# EAGLE schematic RaspiOmix (EAGLE 6.4)
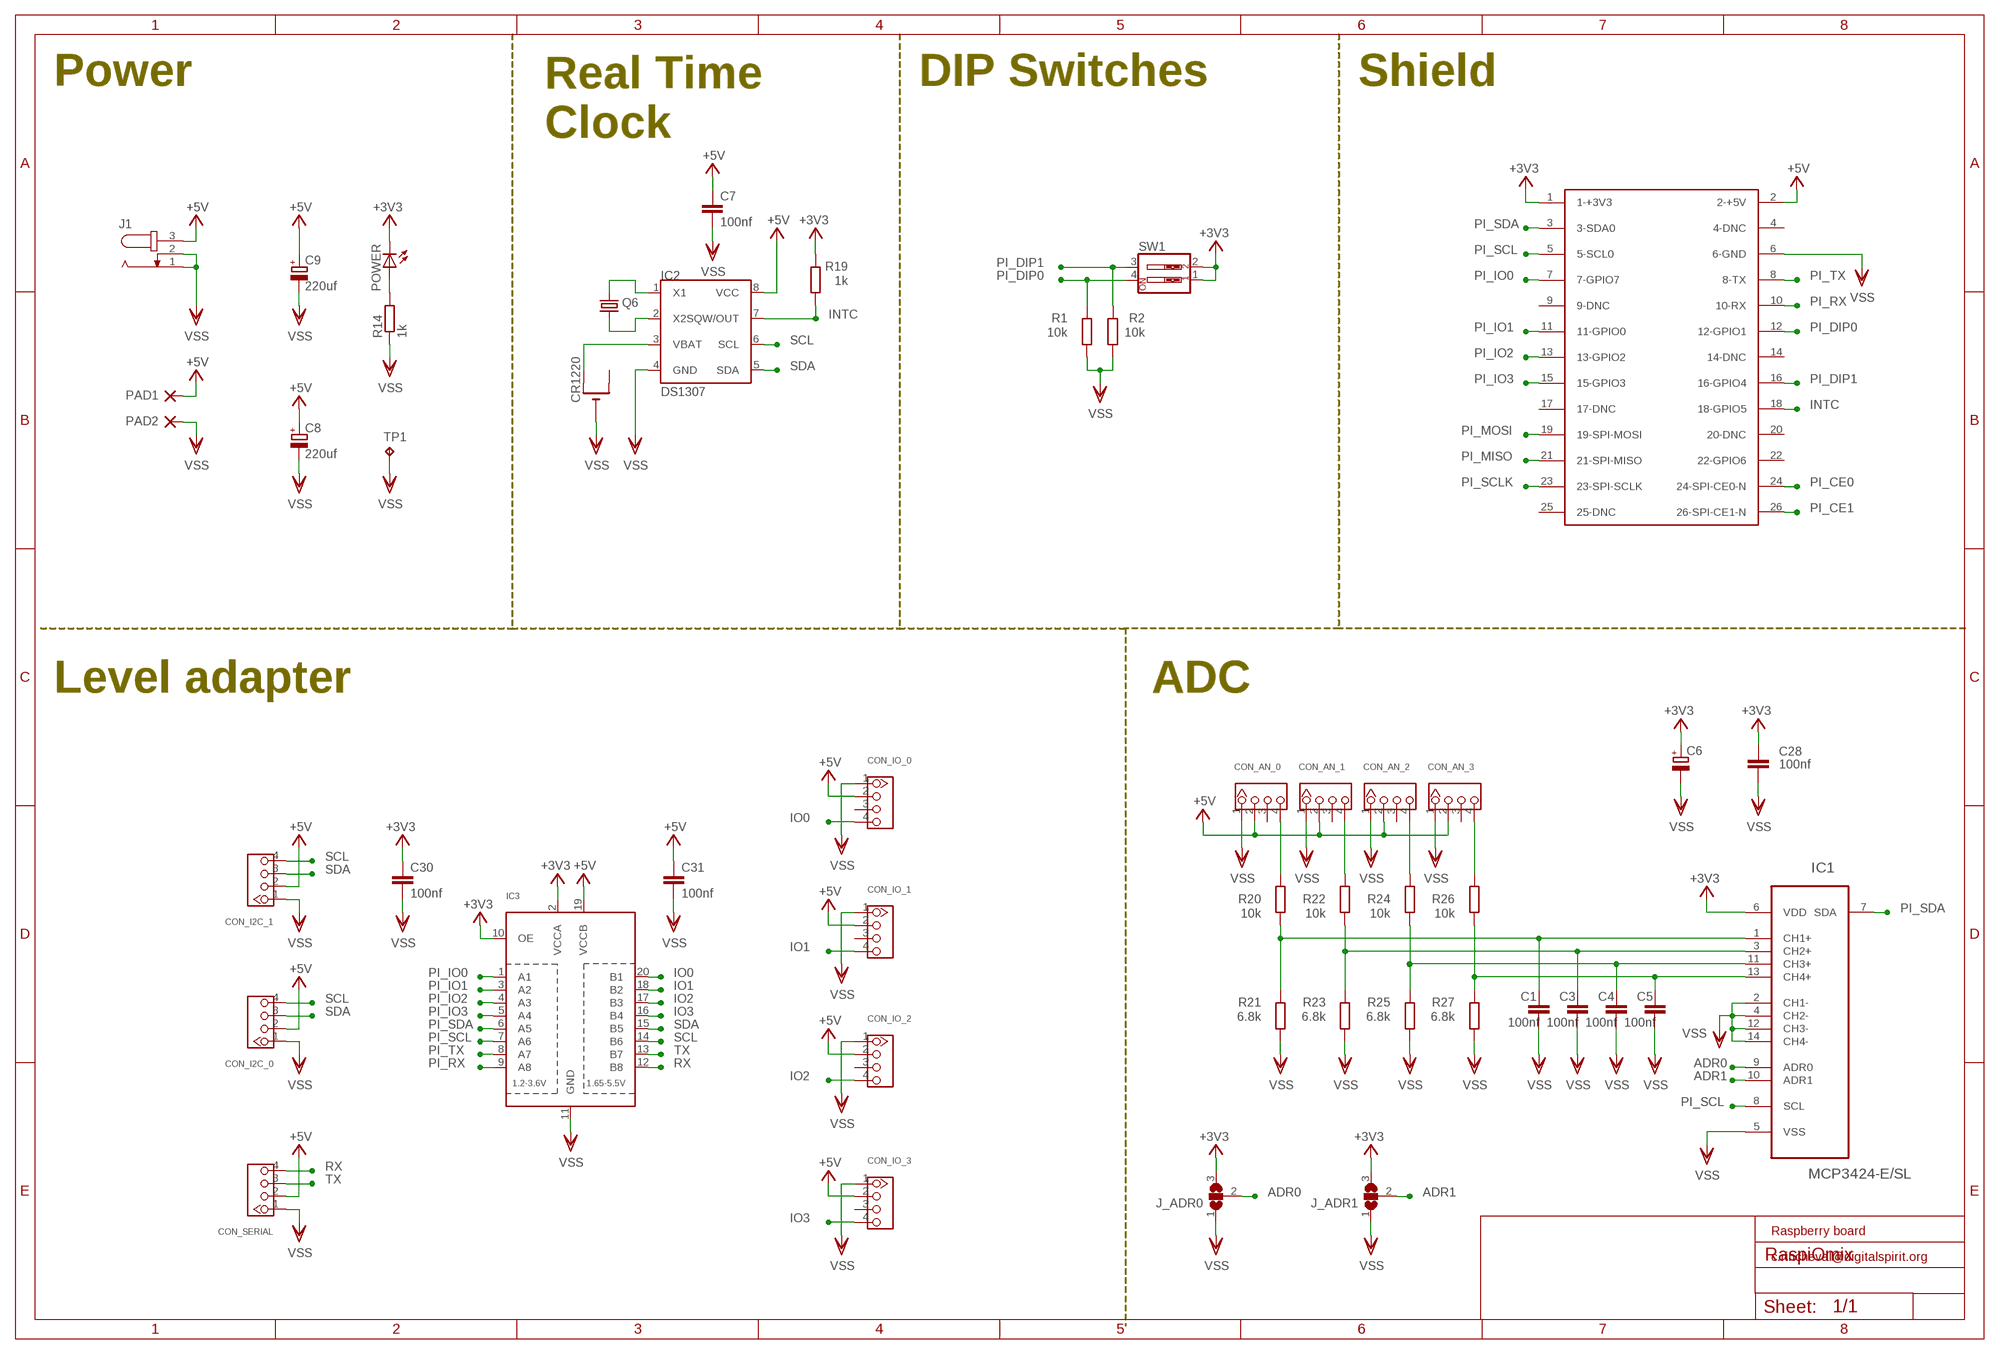
[diagram p0: schematic, sheet 1]

## Parts
C1  100nf  C-EUC0805  [C0805]
C3  100nf  C-EUC0805  [C0805]
C4  100nf  C-EUC0805  [C0805]
C5  100nf  C-EUC0805  [C0805]
C6  CPOL-EUB/3528-21R  [B/3528-21R]
C7  100nf  C-EUC0805  [C0805]
C8  220uf  CPOL-EUD  [PANASONIC_D]
C9  220uf  CPOL-EUD  [PANASONIC_D]
C28  100nf  C-EUC0805  [C0805]
C30  100nf  C-EUC0805  [C0805]
C31  100nf  C-EUC0805  [C0805]
CON_AN_0  TWIG-4P-2.0'90D'  [4P-2.0-90D]
CON_AN_1  TWIG-4P-2.0'90D'  [4P-2.0-90D]
CON_AN_2  TWIG-4P-2.0'90D'  [4P-2.0-90D]
CON_AN_3  TWIG-4P-2.0'90D'  [4P-2.0-90D]
CON_I2C_0  TWIG-4P-2.0'90D'  [4P-2.0-90D]
CON_I2C_1  TWIG-4P-2.0'90D'  [4P-2.0-90D]
CON_IO_0  TWIG-4P-2.0'90D'  [4P-2.0-90D]
CON_IO_1  TWIG-4P-2.0'90D'  [4P-2.0-90D]
CON_IO_2  TWIG-4P-2.0'90D'  [4P-2.0-90D]
CON_IO_3  TWIG-4P-2.0'90D'  [4P-2.0-90D]
CON_SERIAL  TWIG-4P-2.0'90D'  [4P-2.0-90D]
CR1220  CR1220THM  [CR1220-THM]
IC1  MCP3424-E/SL  [SOIC-14]
IC2  DS1307  [SOIC-8]
IC3  TXB0108PWR  [TSSOP20]
J1  JACK-PLUG0  [SPC4077]
J_ADR0  SJ2W  [SJ_2]
J_ADR1  SJ2W  [SJ_2]
PAD1  WIREPAD3,17/1,3  [3,17/1,3]
PAD2  WIREPAD3,17/1,3  [3,17/1,3]
POWER  LEDCHIPLED_0805  [CHIPLED_0805]
Q6  CRYSTALTC26H  [TC26H]
R1  10k  R-EU_M0805  [M0805]
R2  10k  R-EU_M0805  [M0805]
R14  1k  R-EU_M0805  [M0805]
R19  1k  R-EU_M0805  [M0805]
R20  10k  R-EU_M0805  [M0805]
R21  6.8k  R-EU_M0805  [M0805]
R22  10k  R-EU_M0805  [M0805]
R23  6.8k  R-EU_M0805  [M0805]
R24  10k  R-EU_M0805  [M0805]
R25  6.8k  R-EU_M0805  [M0805]
R26  10k  R-EU_M0805  [M0805]
R27  6.8k  R-EU_M0805  [M0805]
SW1  SW_DIP-2  [EDG-02]
TP1  TPPAD1-13  [P1-13]
U$3  RASPBERRY-PILIGHT-HOLE  [RASPBERRY-PI-LIGHT-HOLE]

## Nets
+3V3: C6.+ C28.2 C30.1 IC1.6(VDD) IC3.2(VCCA) IC3.10(OE) J_ADR0.3 J_ADR1.3 POWER.C R19.2 SW1.1 SW1.2 U$3.1(1-+3V3)
+5V: C7.1 C8.+ C9.+ C31.1 CON_AN_0.2 CON_AN_1.2 CON_AN_2.2 CON_AN_3.2 CON_I2C_0.2 CON_I2C_1.2 CON_IO_0.2 CON_IO_1.2 CON_IO_2.2 CON_IO_3.2 CON_SERIAL.2 IC2.8(VCC) IC3.19(VCCB) J1.3 PAD1.1(P) U$3.2(2-+5V)
ADR0: IC1.9(ADR0) J_ADR0.2
ADR1: IC1.10(ADR1) J_ADR1.2
INTC: IC2.7(SQW/OUT) R19.1 U$3.18(18-GPIO5)
IO0: CON_IO_0.4 IC3.20(B1)
IO1: CON_IO_1.4 IC3.18(B2)
IO2: CON_IO_2.4 IC3.17(B3)
IO3: CON_IO_3.4 IC3.16(B4)
N$1: CON_AN_0.4 R20.2
N$2: CON_AN_1.4 R22.2
N$3: CON_AN_2.4 R24.2
N$4: C5.1 IC1.13(CH4+) R26.1 R27.2
N$5: C4.1 IC1.11(CH3+) R24.1 R25.2
N$6: C3.1 IC1.3(CH2+) R22.1 R23.2
N$7: C1.1 IC1.1(CH1+) R20.1 R21.2
N$8: CON_AN_3.4 R26.2
N$33: IC2.1(X1) Q6.1
N$34: IC2.2(X2) Q6.2
N$39: POWER.A R14.2
N$58: CR1220.+1(+) IC2.3(VBAT)
PI_CE0: U$3.24(24-SPI-CE0-N)
PI_CE1: U$3.26(26-SPI-CE1-N)
PI_DIP0: R1.2 SW1.4 U$3.12(12-GPIO1)
PI_DIP1: R2.2 SW1.3 U$3.16(16-GPIO4)
PI_IO0: IC3.1(A1) U$3.7(7-GPIO7)
PI_IO1: IC3.3(A2) U$3.11(11-GPIO0)
PI_IO2: IC3.4(A3) U$3.13(13-GPIO2)
PI_IO3: IC3.5(A4) U$3.15(15-GPIO3)
PI_MISO: U$3.21(21-SPI-MISO)
PI_MOSI: U$3.19(19-SPI-MOSI)
PI_RX: IC3.9(A8) U$3.10(10-RX)
PI_SCL: IC1.8(SCL) IC3.7(A6) U$3.5(5-SCL0)
PI_SCLK: U$3.23(23-SPI-SCLK)
PI_SDA: IC1.7(SDA) IC3.6(A5) U$3.3(3-SDA0)
PI_TX: IC3.8(A7) U$3.8(8-TX)
RX: CON_SERIAL.4 IC3.12(B8)
SCL: CON_I2C_0.4 CON_I2C_1.4 IC2.6(SCL) IC3.14(B6)
SDA: CON_I2C_0.3 CON_I2C_1.3 IC2.5(SDA) IC3.15(B5)
TX: CON_SERIAL.3 IC3.13(B7)
VSS: C1.2 C3.2 C4.2 C5.2 C6.- C7.2 C8.- C9.- C28.1 C30.2 C31.2 CON_AN_0.1 CON_AN_1.1 CON_AN_2.1 CON_AN_3.1 CON_I2C_0.1 CON_I2C_1.1 CON_IO_0.1 CON_IO_1.1 CON_IO_2.1 CON_IO_3.1 CON_SERIAL.1 CR1220.- IC1.2(CH1-) IC1.4(CH2-) IC1.5(VSS) IC1.12(CH3-) IC1.14(CH4-) IC2.4(GND) IC3.11(GND) J1.1 J1.2 J_ADR0.1 J_ADR1.1 PAD2.1(P) R1.1 R2.1 R14.1 R21.1 R23.1 R25.1 R27.1 TP1.TP U$3.6(6-GND)
Unconnected: CON_AN_0.3 CON_AN_1.3 CON_AN_2.3 CON_AN_3.3 CON_IO_0.3 CON_IO_1.3 CON_IO_2.3 CON_IO_3.3 CR1220.+2(+1) U$3.4(4-DNC) U$3.9(9-DNC) U$3.14(14-DNC) U$3.17(17-DNC) U$3.20(20-DNC) U$3.22(22-GPIO6) U$3.25(25-DNC)

## Notes on the sheet
- Power | DIP Switches | Shield
- Real Time
  Clock
- Level adapter | ADC
- Raspberry board
- c.rincheval@digitalspirit.org

## Library data of the parts
C1 C3-C5 C7 C28 C30 C31 = rcl:C-EU: CAPACITOR, European symbol
C6 C8 C9 = rcl:CPOL-EU: POLARIZED CAPACITOR, European symbol
CON_AN_0 CON_AN_1-CON_AN_3 CON_I2C_0 CON_I2C_1 CON_IO_0 CON_IO_1-CON_IO_3 CON_SERIAL = Seeedstudio_Connector:TWIG-4P-2.0
CR1220 = adafruit:CR1220: CR1216/CR1220/CR1225 12mm 3V lithium coin cell Great for battery packup. Both SMT and THM holders. Note the THM package has the ground pads on both sides of the PCB so that the masks are the same - this reduces the cost
IC1 = eagleParts:MCP3424-E/SL
IC2 = eagleParts:DS1307: I2C Serial RTC w/56 bytes battery backed RAM
IC3 = adafruit:TXB0108PWR: 8-Bit Bi-Directional Level Shifter 1.2V-3.6V (VCCA) to 1.65V-5.5V (VCCB) bi-directional level shifter with auto direction sensing. Max data rate - VCCA 1.8V: 20Mbps (50ns), VCCA 3.3V: 100Mbps (10ns) Digikey: 296-21527-1-ND
J1 = con-jack:JACK-PLUG: DC POWER JACK Power Jack, DC, Right Angle, Through Hole, Rated 5A at 16VDC, PC Terminals Distributor: Farnell (www.Farnell.de) Drawing: 84N1161.pdf / 84N1162.pdf Manufacturer: SPC Technology (www.spctechnology.com) Type: SPC4077 / SPC 4078; OC_FARNELL: unknown; OC_NEWARK: unknown
J_ADR0 J_ADR1 = jumper:SJ2W: SMD solder JUMPER
PAD1 PAD2 = wirepad:WIREPAD: Wire PAD connect wire on PCB
POWER = led:LED: LED OSRAM: - CHIPLED LG R971, LG N971, LY N971, LG Q971, LY Q971, LO R971, LY R971 LH N974, LH R974 LS Q976, LO Q976, LY Q976 LO Q996 - Hyper CHIPLED LW Q18S LB Q993, LB Q99A, LB R99A - SideLED LS A670, LO A670, LY A670, LG A670, LP A670 LB A673, LV A673, LT A673, LW A673 LH A674 LY A675 LS A676, LA A676, LO A676, LY A676, LW A676 LS A679, LY A679, LG A679 - Hyper Micro SIDELED® LS Y876, LA Y876, LO Y876, LY Y876 LT Y87S - SmartLED LW L88C, LW L88S LB L89C, LB L89S, LG L890 LS L89K, LO L89K, LY L89K LS L896, LA L896, LO L896, LY L896 - TOPLED LS T670, LO T670, LY T670, LG T670, LP T670 LSG T670, LSP T670, LSY T670, LOP T670, LYG T670 LG T671, LOG T671, LSG T671 LB T673, LV T673, LT T673, LW T673 LH T674 LS T676, LA T676, LO T676, LY T676, LB T676, LH T676, LSB T676, LW T676 LB T67C, LV T67C, LT T67C, LS T67K, LO T67K, LY T67K, LW E67C LS E67B, LA E67B, LO E67B, LY E67B, LB E67C, LV E67C, LT E67C LW T67C LS T679, LY T679, LG T679 LS T770, LO T770, LY T770, LG T770, LP T770 LB T773, LV T773, LT T773, LW T773 LH T774 LS E675, LA E675, LY E675, LS T675 LS T776, LA T776, LO T776, LY T776, LB T776 LHGB T686 LT T68C, LB T68C - Hyper Mini TOPLED® LB M676 - Mini TOPLED Santana® LG M470 LS M47K, LO M47K, LY M47K Source: http://www.osram.convergy.de LUXEON: - LUMILED® LXK2-PW12-R00, LXK2-PW12-S00, LXK2-PW14-U00, LXK2-PW14-V00 LXK2-PM12-R00, LXK2-PM12-S00, LXK2-PM14-U00 LXK2-PE12-Q00, LXK2-PE12-R00, LXK2-PE12-S00, LXK2-PE14-T00, LXK2-PE14-U00 LXK2-PB12-K00, LXK2-PB12-L00, LXK2-PB12-M00, LXK2-PB14-N00, LXK2-PB14-P00, LXK2-PB14-Q00 LXK2-PR12-L00, LXK2-PR12-M00, LXK2-PR14-Q00, LXK2-PR14-R00 LXK2-PD12-Q00, LXK2-PD12-R00, LXK2-PD12-S00 LXK2-PH12-R00, LXK2-PH12-S00 LXK2-PL12-P00, LXK2-PL12-Q00, LXK2-PL12-R00 Source: www.luxeon.com KINGBRIGHT: KA-3528ASYC Source: www.kingbright.com
Q6 = crystal:CRYSTAL: CRYSTAL; OC_FARNELL: unknown; OC_NEWARK: unknown
R1 R2 R14 R19-R27 = rcl:R-EU_: RESISTOR, European symbol
SW1 = special:SW_DIP-2: DIP SWITCH
TP1 = testpad:TP: Test pad
U$3 = RaspberryPi:RASPBERRY-PI: Raspberry Pi Board <http://www.raspberrypi.org/> Jacques Lagnel V1.0 (beta) 2012 Board dimension: Forum 3D model <http://www.raspberrypi.org/forum/general-discussion/mechanical-profile-3d-models?value=3d%20model&type=1&include=1&search=1&ret=all> The GPIO Connector (P1): http://elinux.org/RPi_Low-level_peripherals